# EAGLE design TL8 (EAGLE 5.11)
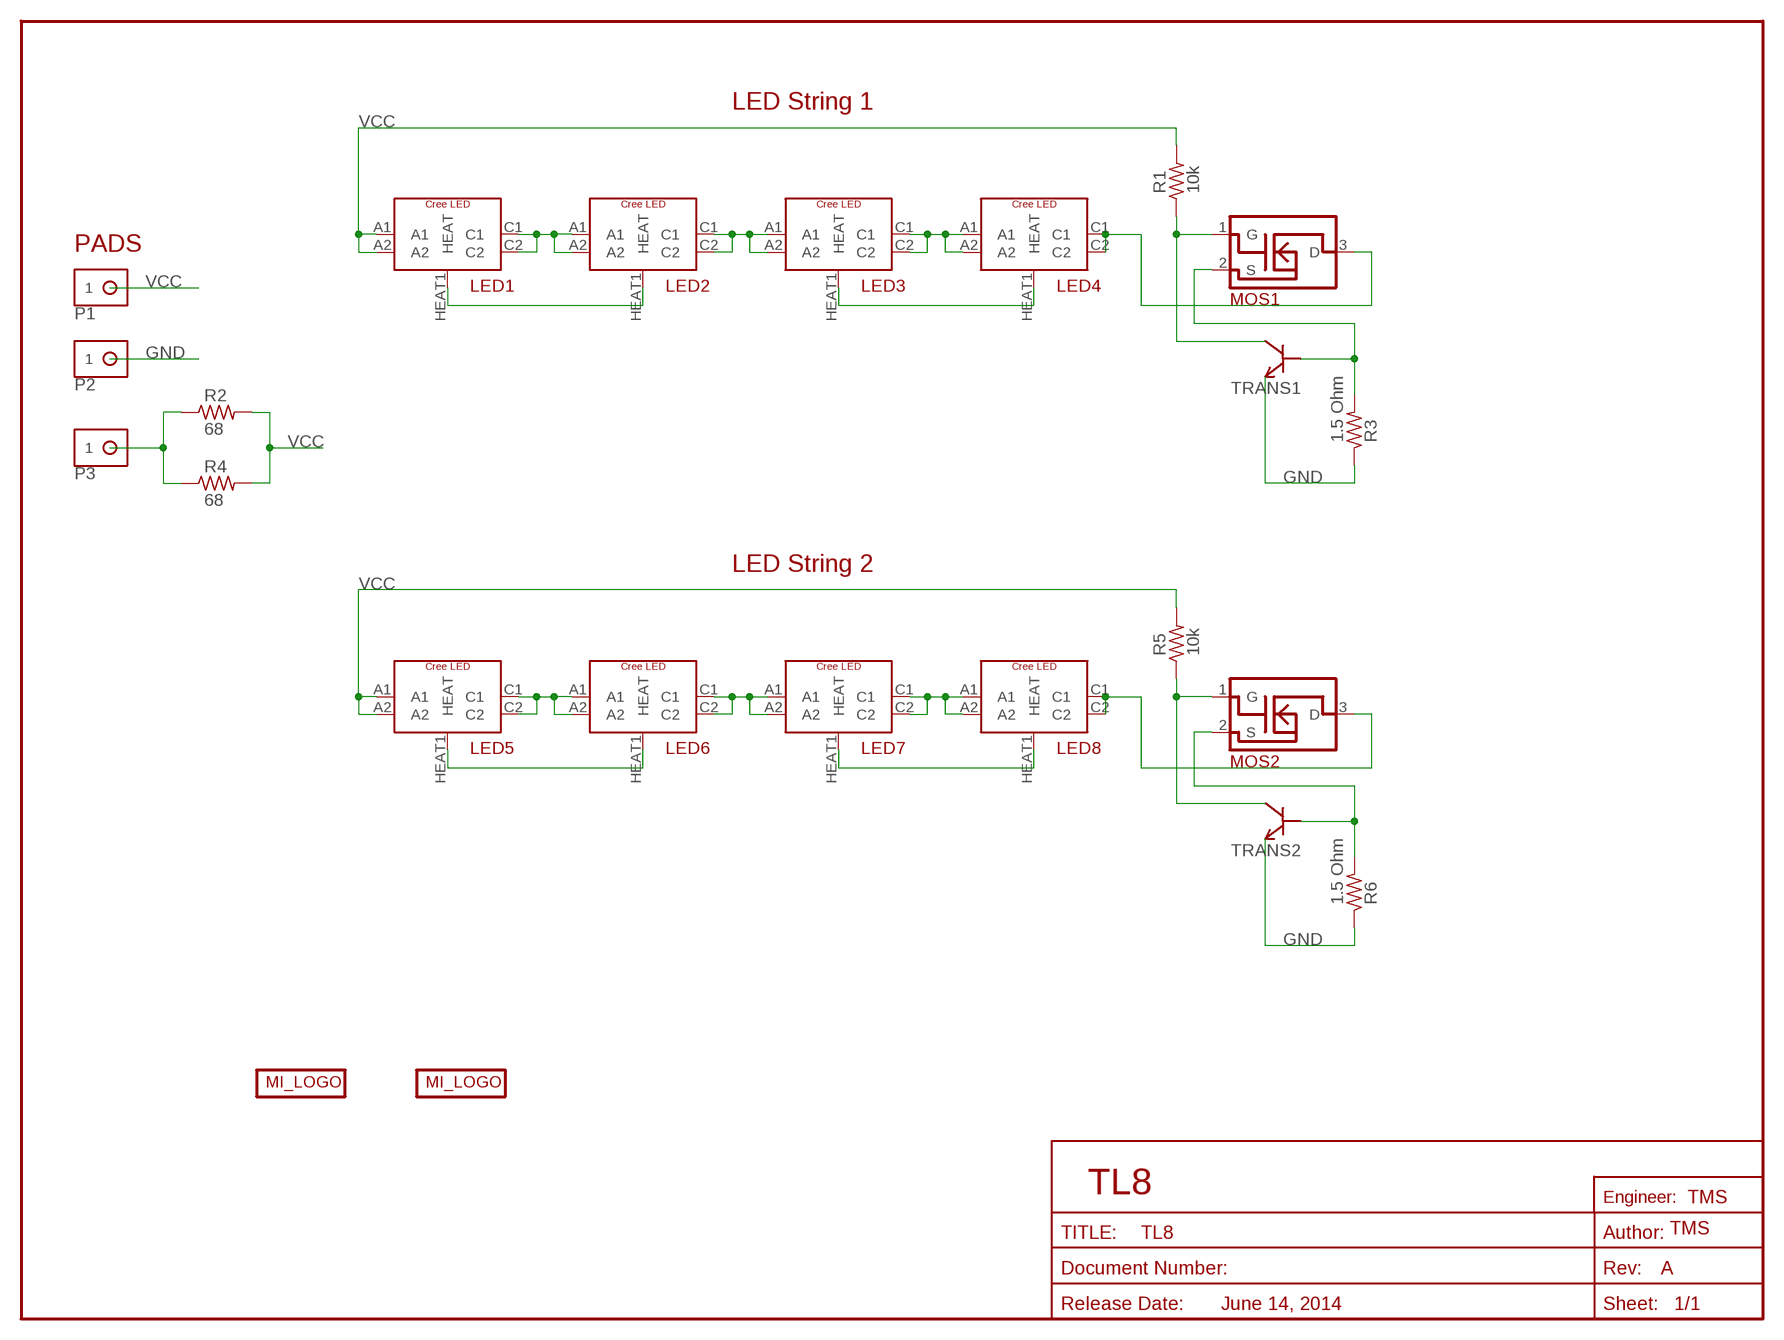
[diagram p0: schematic, sheet 1]

## Parts
LED1  CREE-LEDML-E  [CREE-ML-E]
LED2  CREE-LEDML-E  [CREE-ML-E]
LED3  CREE-LEDML-E  [CREE-ML-E]
LED4  CREE-LEDML-E  [CREE-ML-E]
LED5  CREE-LEDML-E  [CREE-ML-E]
LED6  CREE-LEDML-E  [CREE-ML-E]
LED7  CREE-LEDML-E  [CREE-ML-E]
LED8  CREE-LEDML-E  [CREE-ML-E]
MOS1  SI2318CDS  [SOT23]
MOS2  SI2318CDS  [SOT23]
P1  PAD-10G  [PAD_10G]
P2  PAD-10G  [PAD_10G]
P3  PAD-10G  [PAD_10G]
R1  10k  RES-1210  [PANASONIC_1210]
R2  68  RES-2512  [2512]
R3  1.5 Ohm  RES-S2010  [R2010]
R4  68  RES-2512  [2512]
R5  10k  RES-1210  [PANASONIC_1210]
R6  1.5 Ohm  RES-S2010  [R2010]
TRANS1  PMBS3904-NPN  [SOT23]
TRANS2  PMBS3904-NPN  [SOT23]
U$1  MI_LOGO-NAME_TWO  [MI_LOGO_NAME_2]
U$2  MI_LOGO-2014_USA  [MACRIS_USA_LOGO]

## Nets
GND: P2.1 R3.1 R6.1 TRANS1.2(E) TRANS2.2(E)
HEAT1: LED1.HEAT1(HEAT) LED2.HEAT1(HEAT)
HEAT2: LED3.HEAT1(HEAT) LED4.HEAT1(HEAT)
HEAT3: LED5.HEAT1(HEAT) LED6.HEAT1(HEAT)
HEAT4: LED7.HEAT1(HEAT) LED8.HEAT1(HEAT)
MOS1: LED4.C1 LED4.C2 MOS1.3(D)
N$1: LED5.C1 LED5.C2 LED6.A1 LED6.A2
N$2: LED1.C1 LED1.C2 LED2.A1 LED2.A2
N$3: LED2.C1 LED2.C2 LED3.A1 LED3.A2
N$4: LED3.C1 LED3.C2 LED4.A1 LED4.A2
N$5: MOS1.1(G) R1.P$1 TRANS1.3(C)
N$7: MOS1.2(S) R3.2 TRANS1.1(B)
N$8: LED6.C1 LED6.C2 LED7.A1 LED7.A2
N$9: LED7.C1 LED7.C2 LED8.A1 LED8.A2
N$10: LED8.C1 LED8.C2 MOS2.3(D)
N$14: MOS2.2(S) R6.2 TRANS2.1(B)
N$15: P3.1 R2.P$1 R4.P$1
N$17: MOS2.1(G) R5.P$1 TRANS2.3(C)
VCC: LED1.A1 LED1.A2 LED5.A1 LED5.A2 P1.1 R1.P$2 R2.P$2 R4.P$2 R5.P$2

## Notes on the sheet
- LED String 1
- PADS
- LED String 2
- TL8
- TMS
- TMS
- A
- June 14, 2014

## Library data of the parts
LED1-LED8 = Discrete:CREE-LED
MOS1 MOS2 = IC:SI2318CDS: NMOS, 40V, Vishay Siliconix
P1-P3 = Mechanical:PAD: Solder Pads
R1-R6 = Discrete:RES: Resistor
TRANS1 TRANS2 = Discrete:PMBS3904: NPN Transistor
U$1 U$2 = Logo:MI_LOGO

## Board
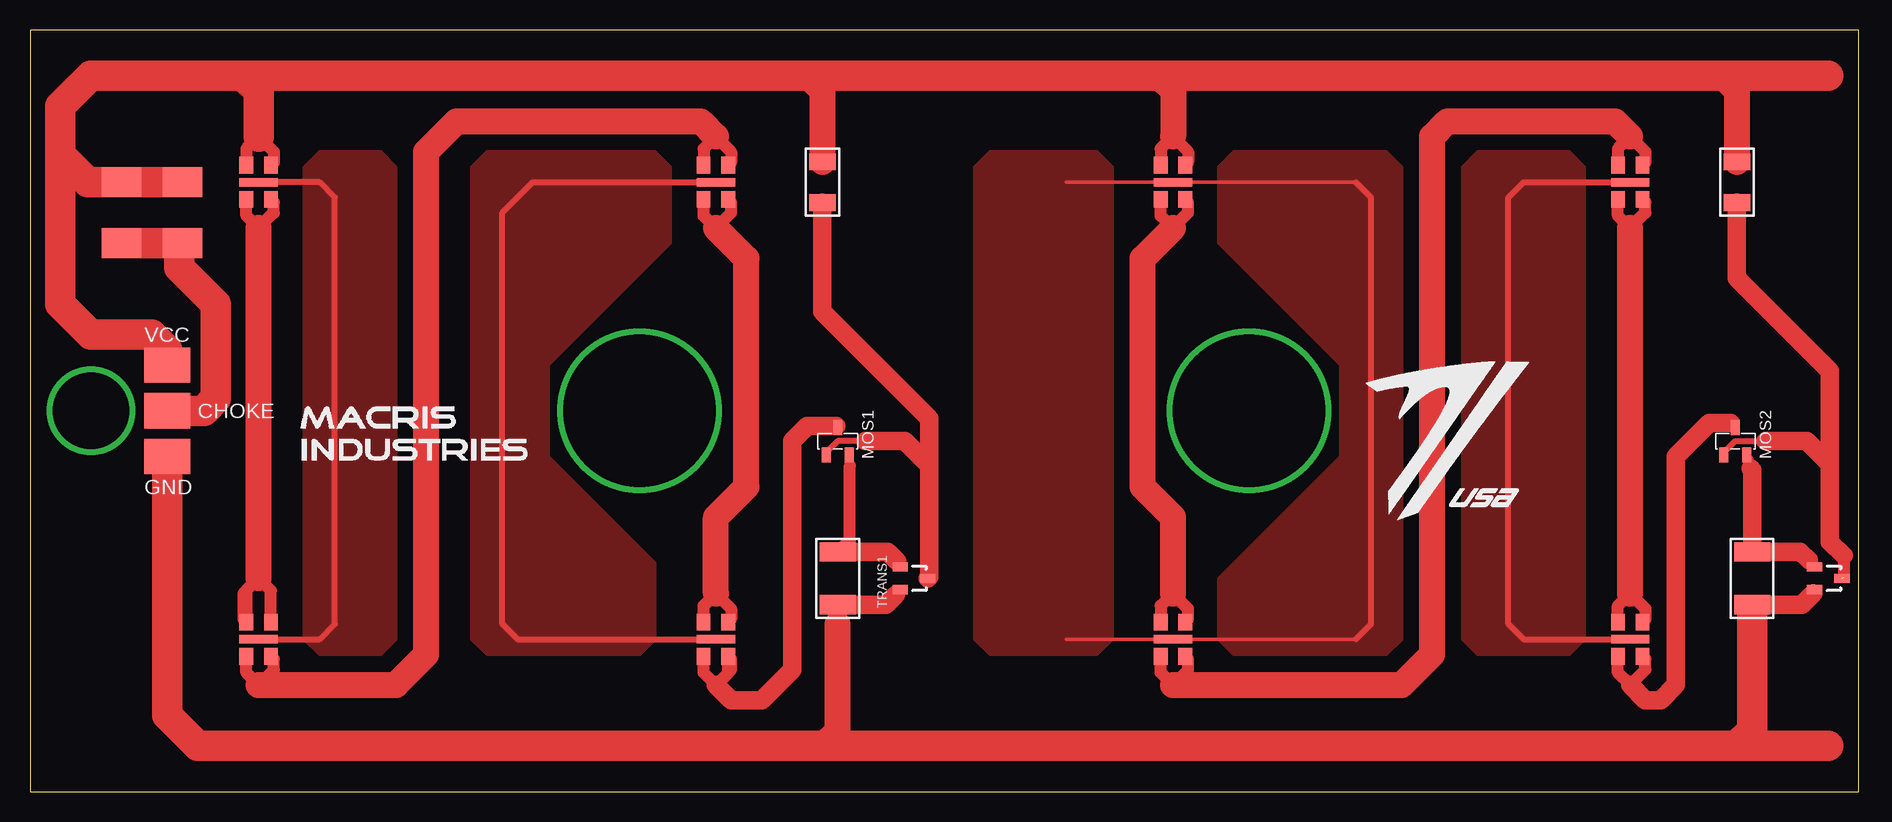
[diagram p1: board, top side]

Size 152.4 x 63.5 mm. Coordinates in mm from the lower left corner, seen from the top.
Outline: 0,0 152.4,0 152.4,63.5 0,63.5 0,0
Copper layers (1*16): Top 0.0356mm / dielectric 1.5011mm / Bottom 0.0356mm
Design rules "oshPark": minimum track width 6mil, minimum drill 13mil, track to track 6mil, track to pad 6mil, pad to pad 6mil, via to via 6mil, smd to smd 6mil, copper to edge 15mil, drill to drill 6mil, minimum pad ring 7mil, minimum via ring 7mil, stop-mask expansion 4mil, vias tented up to drill 0mil, thermal gap 10mil

### Footprints (pad centres in the part's own frame; a part is rotated, then mirrored left to right if it is on the bottom)
CREE-ML-E = smd 1.395 x 1.15: A1 -1.427,1.025; A2 -1.427,-1.025; C1 1.427,1.025; C2 1.427,-1.025 | smd 0.7 x 3.2: HEAT1 0,0
SOT23 = smd 0.762 x 1.27: 1 -0.953,-1.143; 2 0.953,-1.143; 3 0,1.143
PAD_10G = smd 3.81 x 2.921: 1 0,0
PANASONIC_1210 = smd 1.4 x 2.2: P$1 1.7,0; P$2 -1.7,0
2512 = smd 2.5 x 3.3: P$1 -2.54,0; P$2 2.54,0
R2010 = smd 1.6 x 3: 1 -2.2,0; 2 2.2,0

### Placement (x,y rotation side)
LED1  19.05,50.8 270 top
LED2  19.05,12.7 270 top
LED3  57.15,50.8 270 top
LED4  57.15,12.7 270 top
LED5  95.25,50.8 270 top
LED6  95.25,12.7 270 top
LED7  133.35,50.8 270 top
LED8  133.35,12.7 270 top
MOS1  67.31,29.21 0 top
MOS2  142.11,29.21 0 top
P1  11.43,35.56 0 top
P2  11.43,27.94 180 top
P3  11.43,31.75 0 top
R1  66.04,50.8 270 top
R2  12.7,48.26 90 top
R3  67.31,17.78 90 top
R4  7.62,48.26 90 top
R5  142.24,50.8 270 top
R6  143.51,17.78 90 top
TRANS1  73.66,17.78 270 top
TRANS2  149.86,17.78 270 top
U$1  22.23,27.3 0 top
U$2  110.49,21.59 0 top

### Tracks (layer width: path | path; a pad name or v marks a point on that pad's centre or on a via)
GND
  Top 0.305: 72.14,16.38 72.14,16.45 TRANS1.2 | 67.31,13.97 R3.1 | 148.59,16.51 148.59,16.7 TRANS2.2 | 143.51,14.61 R6.1
  Top 1.524: R3.1 71.33,15.58 72.14,16.38 | R6.1 147.66,15.58 148.59,16.51
  Top 2.184: 67.31,13.97 67.31,5.08 66.04,3.81
  Top 2.54: 142.24,3.81 149.86,3.81 | 142.24,3.81 66.04,3.81 13.97,3.81 11.43,6.35 P2.1 | 142.24,3.81 143.51,5.08 143.51,14.61
HEAT1
  Top 0.508: LED2.HEAT1 24.13,12.7 25.4,13.97 25.4,49.53 24.13,50.8 LED1.HEAT1
  pour Top: 22.86,49.53 22.86,52.07 24.13,53.34 29.21,53.34 30.48,52.07 30.48,12.7 29.21,11.43 24.13,11.43 22.86,12.7
HEAT2
  Top 0.508: LED3.HEAT1 41.91,50.8 39.37,48.26 39.37,13.97 40.64,12.7 LED4.HEAT1
  pour Top: 50.8,53.34 38.1,53.34 36.83,52.07 36.83,12.7 38.1,11.43 50.8,11.43 52.07,12.7 52.07,19.05 43.18,27.94 43.18,35.56 53.34,45.72 53.34,52.07 52.07,53.34
HEAT3
  Top 0.305: 86.36,12.7 LED6.HEAT1 110.49,12.7 | 86.36,50.8 LED5.HEAT1 110.49,50.8
  Top 0.508: 110.49,12.7 111.76,13.97 111.76,49.53 110.49,50.8
  pour Top: 99.06,49.53 99.06,52.07 100.33,53.34 113.03,53.34 114.3,52.07 114.3,12.7 113.03,11.43 100.33,11.43 99.06,12.7 99.06,17.78 109.22,27.94 109.22,35.56 99.06,45.72
  pour Top: 90.17,50.8 90.17,52.07 88.9,53.34 80.01,53.34 78.74,52.07 78.74,12.7 80.01,11.43 88.9,11.43 90.17,12.7
HEAT4
  Top 0.508: LED7.HEAT1 124.46,50.8 123.19,49.53 123.19,13.97 124.46,12.7 LED8.HEAT1
  pour Top: 119.38,52.07 119.38,12.7 120.65,11.43 128.27,11.43 129.54,12.7 129.54,52.07 128.27,53.34 120.65,53.34
MOS1
  Top 0.508: 67.18,30.48 MOS1.3
  Top 1.016: LED4.C2 56.12,9.91 57.15,8.89 58.17,9.91 | 58.17,9.91 58.42,10.16 58.42,11.03 LED4.C1 58.17,9.91
  Top 1.524: 57.15,8.89 58.42,7.62 60.96,7.62 63.5,10.16 63.5,29.21 64.77,30.48 67.18,30.48
N$1
  Top 1.016: LED5.C2 94.22,48.02 95.25,46.99 96.52,48.26 96.52,49.13 LED5.C1 | LED6.A2 94.22,15.48 95.25,16.51 96.52,15.24 96.52,14.37 LED6.A1
  Top 2.184: 95.25,46.99 92.71,44.45 92.71,25.4 95.25,22.86 95.25,16.51
N$2
  Top 1.016: LED2.A1 20.07,16.75 19.05,17.78 18.02,16.75 | 18.02,16.75 17.78,16.51 17.78,14.37 LED2.A2 18.02,16.75 | LED1.C2 18.02,48.02 19.05,46.99 20.32,48.26 20.32,49.13 LED1.C1
  Top 2.184: 19.05,17.78 19.05,46.99
N$3
  Top 1.016: LED2.C2 18.02,9.91 19.05,8.89 20.32,10.16 20.32,11.03 LED2.C1 | LED3.A1 58.42,52.47 58.42,53.34 57.15,54.61 56.12,53.59 LED3.A2
  Top 2.184: 57.15,54.61 55.88,55.88 35.56,55.88 33.02,53.34 33.02,11.43 30.48,8.89 19.05,8.89
N$4
  Top 1.016: LED4.A2 56.12,15.48 57.15,16.51 58.42,15.24 58.42,14.37 LED4.A1 | LED3.C2 56.12,48.02 57.15,46.99 58.42,48.26 58.42,49.13 LED3.C1
  Top 2.184: 57.15,46.99 59.69,44.45 59.69,25.4 57.15,22.86 57.15,16.51
N$5
  Top 0.508: MOS1.1 66.36,28.26 67.31,29.21 69.6,29.21
  Top 1.524: R1.P$1 66.04,40.01 74.93,31.11 74.93,27.18 | 74.93,27.18 74.93,17.91 TRANS1.3 | 69.6,29.21 70.48,29.21 72.9,29.21 74.93,27.18
N$7
  Top 0.305: 72.26,19.18 72.26,18.99 TRANS1.1
  Top 0.508: MOS1.2 68.26,27.24 68.33,27.18
  Top 1.016: 68.33,27.18 68.33,21 R3.2
  Top 1.524: R3.2 71.46,19.98 72.26,19.18
N$8
  Top 1.016: LED7.A1 134.62,52.47 134.62,53.34 133.35,54.61 132.32,53.59 LED7.A2 | LED6.C2 94.22,9.91 95.25,8.89 96.52,10.16 96.52,11.03 LED6.C1
  Top 2.184: 133.35,54.61 132.08,55.88 118.11,55.88 116.84,54.61 116.84,11.43 114.3,8.89 95.25,8.89
N$9
  Top 1.016: LED7.C2 132.32,48.02 133.35,46.99 134.62,48.26 134.62,49.13 LED7.C1 | LED8.A2 132.32,15.48 133.35,16.51 134.62,15.24 134.62,14.37 LED8.A1
  Top 2.184: 133.35,16.51 133.35,46.99
N$10
  Top 0.508: 141.73,30.73 MOS2.3
  Top 1.016: LED8.C2 132.32,9.91 133.35,8.89 134.62,10.16 134.62,11.03 LED8.C1
  Top 1.524: 133.35,8.89 134.62,7.62 135.89,7.62 137.16,8.89 137.16,27.94 139.95,30.73 141.73,30.73
N$11  (via drill 12.7)
  other vias: 50.8,31.75
N$12  (via drill 12.7)
  other vias: 101.6,31.75
N$13  (via drill 6.35)
  other vias: 5.08,31.75
N$14
  Top 0.305: TRANS2.1 148.72,18.8 148.21,19.3 147.83,19.68
  Top 0.508: 143.38,26.92 143.38,27.75 MOS2.2
  Top 1.524: 148.21,19.3 147.53,19.98 R6.2 143.51,26.8 143.38,26.92
N$15
  Top 2.54: P3.1 14.48,31.75 15.49,32.77 15.49,40.64 12.45,43.69 12.45,45.47 R2.P$1 R4.P$1
N$17  (1 unrouted)
  Top 0.508: MOS2.1 141.16,28.26 142.11,29.21 144.65,29.21
  Top 1.016: 151.13,19.68 151.13,17.91
  Top 1.524: R5.P$1 142.24,42.8 149.99,35.05 149.99,27.3 | 149.99,27.3 149.99,20.83 151.13,19.68 | 144.65,29.21 146.05,29.21 148.08,29.21 149.99,27.3
VCC
  Top 1.016: LED1.A2 18.02,53.59 19.05,54.61 20.32,53.34 20.32,52.47 LED1.A1 | LED5.A2 94.22,53.59 95.25,54.61 96.52,53.34 96.52,52.47 LED5.A1
  Top 2.184: R5.P$2 142.24,58.42 140.97,59.69 | R1.P$2 66.04,58.42 64.77,59.69 93.98,59.69 95.25,58.42 95.25,54.61
  Top 2.54: 149.86,59.69 140.97,59.69 64.77,59.69 17.78,59.69 | 17.78,59.69 19.05,58.42 19.05,54.61 | P1.1 11.43,36.83 10.16,38.1 5.08,38.1 2.54,40.64 2.54,53.09 | R2.P$2 R4.P$2 4.83,50.8 2.54,53.09 | 2.54,53.09 2.54,57.15 5.08,59.69 17.78,59.69

### Text on the board
tNames: VCC | CHOKE | GND
Document: 6" | 2.5"